# Altium schematic sheet Power_Architecture.SchDoc
size Tabloid; SheetNumber: 2; SheetTotal: 13
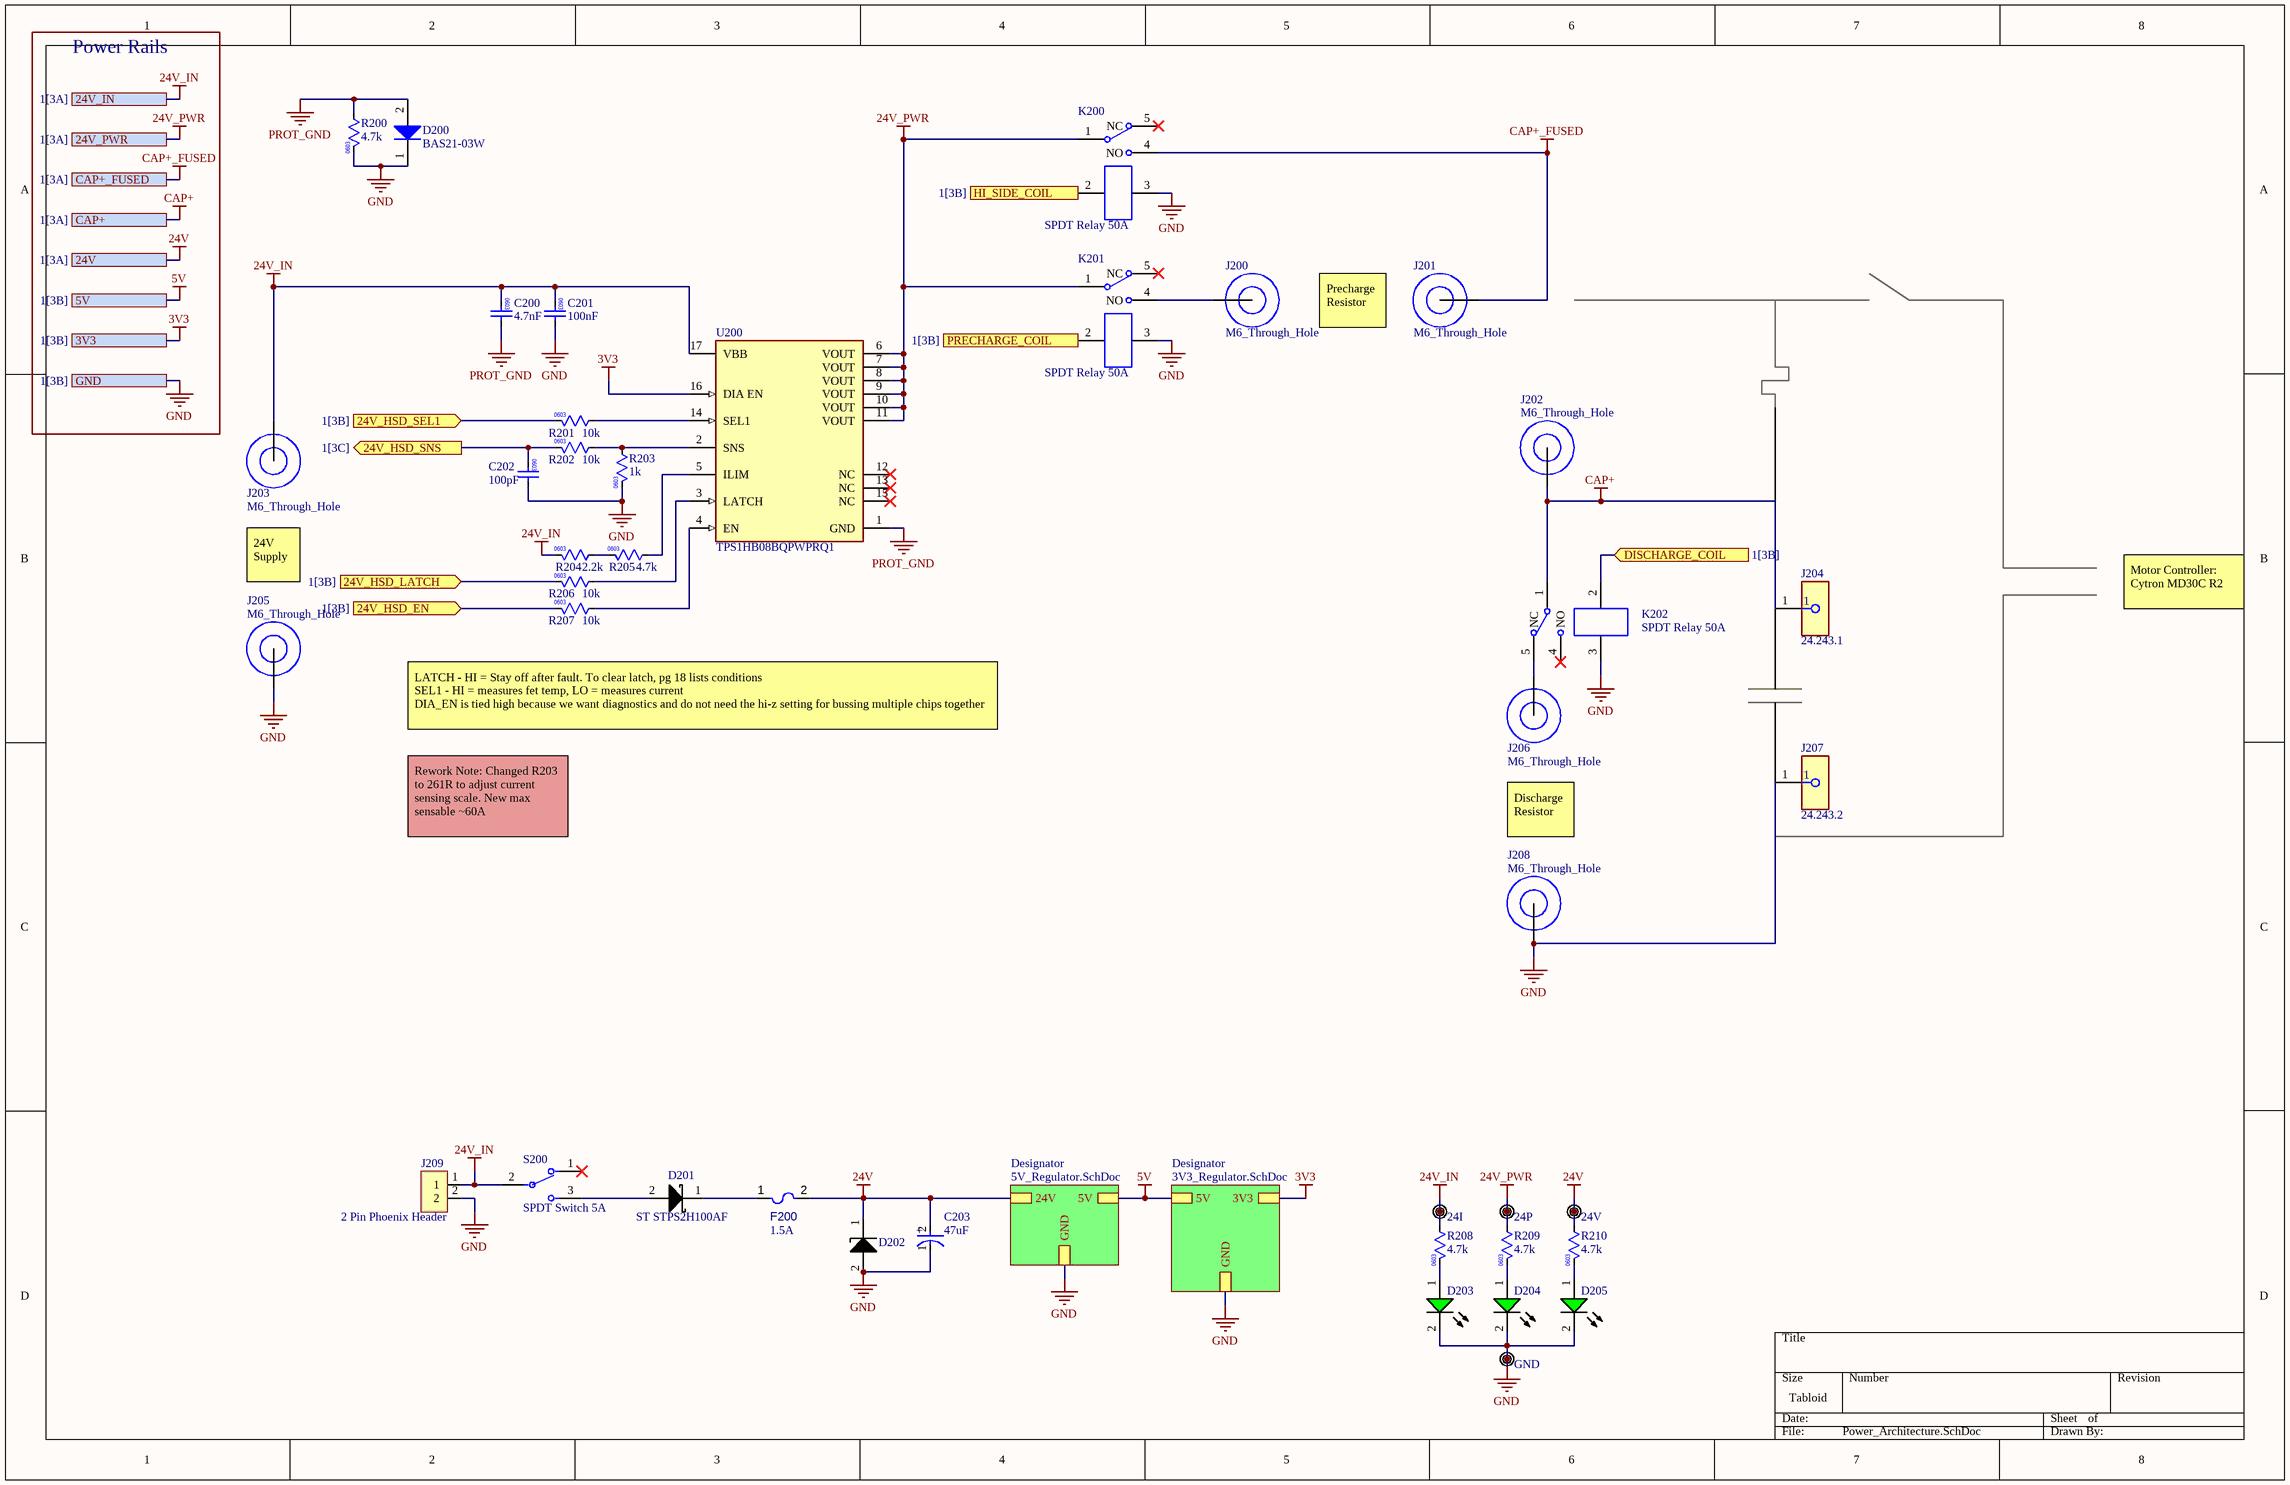
[diagram p0: Power_Architecture.SchDoc]

## Parts
C200  value 4.7nF  [0603 Capacitor Footprint]  (hidden comment: 0603 4.7nF 10% 50V)
C201  value 100nF  [0603 Capacitor Footprint]  (hidden comment: 0603 0.1uF 5% 50V)
C202  value 100pF  [0603 Capacitor Footprint]  (hidden comment: 0603 100pF 10% 50V)
C203  Capacitance: 47uF  [FP-FPD-MFG]  (hidden comment: EEEFP1V470AP)
D200  BAS21-03W  [INF-SOD323_V]
D201  ST STPS2H100AF  [ST STPS2H100AF]
D202  Vishay SMAJ24A-E3/5A  [VISHAY SMAJ24A-E3/5A (DO214AC/SMA)]  (value not drawn)
D203  Lite-On LTST-C193KGKT-5A  [Lite-On LTST-C193KGKT-5A GREEN (1608)]  (value not drawn)
D204  Lite-On LTST-C193KGKT-5A  [Lite-On LTST-C193KGKT-5A GREEN (1608)]  (value not drawn)
D205  Lite-On LTST-C193KGKT-5A  [Lite-On LTST-C193KGKT-5A GREEN (1608)]  (value not drawn)
F200  Current Rating: 1.5A  [LFUS-467_V]  (hidden comment: 1.5A 32V Fuse 0603)
GND  Thru-Hole Test Point  [TESTPOINT]  (value not drawn)  (no BOM)
J200  M6_Through_Hole  [M6_Through_Hole]  (no BOM)
J201  M6_Through_Hole  [M6_Through_Hole]  (no BOM)
J202  M6_Through_Hole  [M6_Through_Hole]  (no BOM)
J203  M6_Through_Hole  [M6_Through_Hole]  (no BOM)
J204  24.243.1  [FP-24_243_1-MFG]
J205  M6_Through_Hole  [M6_Through_Hole]  (no BOM)
J206  M6_Through_Hole  [M6_Through_Hole]  (no BOM)
J207  24.243.2  [FP-24_243_2-MFG]
J208  M6_Through_Hole  [M6_Through_Hole]  (no BOM)
J209  2 Pin Phoenix Header  [2 Pin Phoenix Header]
K200  SPDT Relay 50A  [SPDT Relay 50A]
K201  SPDT Relay 50A  [SPDT Relay 50A]
K202  SPDT Relay 50A  [SPDT Relay 50A]
R200  value 4.7k  [0603 Resistor Footprint]  (hidden comment: 0603 4k7 1% 0.33W)
R201  value 10k  [0603 Resistor Footprint]  (hidden comment: 0603 10k 1% 0.3W)
R202  value 10k  [0603 Resistor Footprint]  (hidden comment: 0603 10k 1% 0.3W)
R203  value 1k  [0603 Resistor Footprint]  (hidden comment: 0603 1k 1% 0.33W)
R204  value 2.2k  [0603 Resistor Footprint]  (hidden comment: 0603 2k2 1% 0.25W)
R205  value 4.7k  [0603 Resistor Footprint]  (hidden comment: 0603 4k7 1% 0.33W)
R206  value 10k  [0603 Resistor Footprint]  (hidden comment: 0603 10k 1% 0.3W)
R207  value 10k  [0603 Resistor Footprint]  (hidden comment: 0603 10k 1% 0.3W)
R208  value 4.7k  [0603 Resistor Footprint]  (hidden comment: 0603 4k7 1% 0.33W)
R209  value 4.7k  [0603 Resistor Footprint]  (hidden comment: 0603 4k7 1% 0.33W)
R210  value 4.7k  [0603 Resistor Footprint]  (hidden comment: 0603 4k7 1% 0.33W)
S200  SPDT Switch 5A  [SPDT 5A]
TP200  24I  [TESTPOINT]  (no BOM)
TP201  24P  [TESTPOINT]  (no BOM)
TP202  24V  [TESTPOINT]  (no BOM)
U200  TPS1HB08BQPWPRQ1  [FP-PWP0016M-MFG]

## Sub-sheets
Designator = 5V_Regulator.SchDoc: 24V, 5V, GND
Designator = 3V3_Regulator.SchDoc: 5V, GND, 3V3

## Ports
3V3 (see 1[3B]), 5V (see 1[3B]), 24V (see 1[3A]), 24V_HSD_EN (in, see 1[3B]), 24V_HSD_LATCH (in, see 1[3B]), 24V_HSD_SEL1 (in, see 1[3B]), 24V_HSD_SNS (out, see 1[3C]), 24V_IN (see 1[3A]), 24V_PWR (see 1[3A]), CAP+ (see 1[3A]), CAP+_FUSED (see 1[3A]), DISCHARGE_COIL (in, see 1[3B]), GND (see 1[3B]), HI_SIDE_COIL (in, see 1[3B]), PRECHARGE_COIL (in, see 1[3B])

## Nets
3V3: U200.16(DIA_EN) ; port 3V3, sheet Designator/3V3
5V: port 5V, sheet Designator/5V, sheet Designator/5V
24V: C203.2(A) D202.1 F200.2 R210.1 TP202.1(TP) ; port 24V, sheet Designator/24V
24V_IN: C200.2 C201.2 J203.1 J209.1 R204.2 R208.1 S200.2 TP200.1(TP) U200.17(VBB) ; port 24V_IN
24V_PWR: K200.1 K201.1 R209.1 TP201.1(TP) U200.6(VOUT) U200.7(VOUT) U200.8(VOUT) U200.9(VOUT) U200.10(VOUT) U200.11(VOUT) ; port 24V_PWR
CAP+: J202.1 J204.1 K202.1 ; port CAP+
CAP+_FUSED: J201.1 K200.4(NO) ; port CAP+_FUSED
GND: C201.1 C202.1 C203.1(C) D200.1(K) D202.2 D203.2(K) D204.2(K) D205.2(K) GND.1(TP) J205.1 J207.1 J208.1 J209.2 K200.3 K201.3 K202.3 R200.2 R203.2 ; port GND, sheet Designator/GND, sheet Designator/GND
PROT_GND: C200.1 D200.2(A) R200.1 U200.1(GND)
24V_HSD_EN: R207.2 ; port 24V_HSD_EN
24V_HSD_LATCH: R206.2 ; port 24V_HSD_LATCH
24V_HSD_SEL1: R201.2 ; port 24V_HSD_SEL1
24V_HSD_SNS: C202.2 R202.2 ; port 24V_HSD_SNS
DISCHARGE_COIL: K202.2 ; port DISCHARGE_COIL
HI_SIDE_COIL: K200.2 ; port HI_SIDE_COIL
PRECHARGE_COIL: K201.2 ; port PRECHARGE_COIL
NetD201_1: D201.1 F200.1
NetD201_2: D201.2 S200.3
NetD203_1: D203.1(A) R208.2
NetD204_1: D204.1(A) R209.2
NetD205_1: D205.1(A) R210.2
NetJ200_1: J200.1 K201.4(NO)
NetJ206_1: J206.1 K202.5(NC)
NetR201_1: R201.1 U200.14(SEL1)
NetR202_1: R202.1 R203.1 U200.2(SNS)
NetR204_1: R204.1 R205.2
NetR205_1: R205.1 U200.5(ILIM)
NetR206_1: R206.1 U200.3(LATCH)
NetR207_1: R207.1 U200.4(EN)

Not connected (* = marked no-connect by the designer): K200 5(NC)*; K201 5(NC)*; K202 4(NO)*; S200 1*; U200 12(NC)* 13(NC)* 15(NC)*

## Notes on the sheet
- Power Rails
- Precharge Resistor
- 24V Supply
- Motor Controller: Cytron MD30C R2
- LATCH - HI = Stay off after fault. To clear latch, pg 18 lists conditions
  SEL1 - HI = measures fet temp, LO = measures current
  DIA_EN is tied high because we want diagnostics and do not need the hi-z setting for bussing multiple chips together
- Rework Note: Changed R203 to 261R to adjust current sensing scale. New max sensable ~60A
- Discharge Resistor
- (in symbol CMP-009-00190-8) 0603
- (in symbol CMP-2000-06216-2) +

## Library data of the parts
C200 = CMP-001-00087-1: Ceramic Capacitor, Multilayer, Ceramic, 50V, 10% Tol, X7R, 15% TC, 0.0047uF, Surface Mount, 0603; Max Operating Temperature: 125°C; Case/Package: 0603; Capacitor Type: Ceramic; Min Operating Temperature: -55°C; Tolerance: 10%; Supplier Part Number 1: 13-CC0603KPX7R9BB101CT-ND; RoHS Compliant: Yes; Temperature Characteristics Code: X7R; Mounting Technology: Surface Mount; Source: UBC Formula Electric.SchLib; Voltage Rating: 50V; Pins: 2
C201 = CMP-001-00091-5: CAP CER 0.1UF 50V X7R 0603; Manufacturer Part Number: CC0603JPX7R9BB104; Capacitor Type: Ceramic; Case/Package: 0603; Tolerance: 5%; Voltage Rating: 50V; Mounting Technology: SF
C202 = CMP-001-00096-1: Ceramic Capacitor, Multilayer, Ceramic, 50V, 10% +Tol, 10% -Tol, X7R, 15% TC, 0.0001uF, Surface Mount, 0603; Min Operating Temperature: -55°C; Voltage Rating: 50V; Tolerance: 10%; Supplier 1: Yageo; Capacitor Type: Ceramic; Pins: 2; Case/Package: 0603; Mounting Technology: Surface Mount; RoHS Compliant: Yes; Source: UBC Formula Electric.SchLib; Max Operating Temperature: 125°C; Supplier Part Number 1: 13-CC0603KPX7R9BB101CT-ND; Temperature Characteristics Code: X7R
C203 = CMP-2000-06216-2: CAP ALUM 47UF 20% 35V SMD; Ripple Current: 300mA; ESR (Equivalent Series Resistance): 260mR; Life (Hours): 2000Hour; Leakage Current: 3uA; Dissipation Factor: 0.12%; Material: Aluminium; Series: FP; Construction: Cylindrical; Contact Plating: Tin; Termination: SMD/SMT; RoHS Compliant: Yes; Voltage Rating (DC): 35V; Package Quantity: 1; Tolerance: 20%; Mount: Surface Mount; Diameter: 6.3mm; Lead Free: Lead Free; Number of Pins: 2; Radiation Hardening: No; REACH SVHC: No SVHC; Length: 5.8mm; Height - Seated (Max): 0.228inch; Ripple Current (AC): 300mA; Packaging: Tape and Reel; Voltage Rating: 35V; Min Operating Temperature: -55°C; Voltage: 35V; Case/Package: Radial; Max Operating Temperature: 105°C; Height: 5.8mm; Lead Pitch: 1.8mm
D200 = CMP-1176-00009-1: Silicon Switching Diode, SOD323, Reel, Green; Manufacturer: Infineon; IF (max): 250Â mA; VBR (min): 250Â V; Green: TRUE; Configuration: Single; VR (max): 200Â V; IR (max): 100Â nA; VF (max): 1.25Â V; trr (max): 50Â ns; PackageReference: SOD323; ComponentLink3URL: http://www.infineon.com/dgdl/SOD323-Package_Overview.pdf?folderId=db3a30431936bc4b011952aab84f3bbe&fileId=db3a30431936bc4b011952beed653be3; ComponentLink1URL: http://www.infineon.com/; Mounting Technology: Surface Mount; ComponentLink3Description: Package Specification; ComponentLink2URL: http://www.infineon.com/dgdl/bas21series.pdf?folderId=db3a30431400ef6801141b5844e103ea&fileId=db3a30431400ef6801141bed353f040f; PartNumber: BAS21-03W; ComponentLink2Description: Datasheet; ComponentLink1Description: Manufacturer URL; PackageDescription: 2-Pin Small Outline Diode Package, 1.25 x 1.7 mm Body
D201 = CMP-011-0012-1: Diode Schottky 100V 2A Surface Mount SMAflat; Component Type: Standard; Source: Quad_Inverter.SchLib; Design Item ID: ST STPS2H100AF; Pins: 2
D202 = CMP-024-000024-1: TVS DIODE 24V 38.9V DO214AC; Source: UBC Formula Electric.SchLib; Supplier Part Number 1: SMAJ24A-E3/5AGICT-ND; Reverse Standoff: 24V; Design Item ID: Vishay SMAJ24A-E3/5A; Supplier 1: Digi-Key
D203-D205 = CMP-026-000009-1: LED GREEN CLEAR CHIP SMD; Source: UBC Formula Electric.SchLib; Supplier 1: Digi-Key; Supplier Part Number 1: 160-1828-1-ND; Design Item ID: Lite-On LTST-C193KGKT-5A
F200 = CMP-005-00014-1: Electric Fuse, Slow Blow, 1.5A, 32VDC, 50A (IR), Surface Mount; Case/Package: 0603; Pins: 2; Min Operating Temperature: -20°C; Max Operating Temperature: 105°C; Mounting Technology: Surface Mount; Voltage Rating - DC: 32V; RoHS Compliant: Yes
GND TP200-TP202 = CMP-020-0000-4: Design Item ID: Thru-Hole Test Point; Source: UBC Formula Electric.SchLib
J204 = CMP-12400-000001-2: Banana Test Connector, 4mm, Socket, PCB Mount, 24 A, 60 VDC, Silver Plated Contacts, Green; Gender: Male; Voltage Rating: 30V; Current Rating: 20A; REACH SVHC: No SVHC; Contact Material: Brass; RoHS Compliant: Yes; Contact Plating: Silver; Voltage Rating (DC): 30V; Length: 24mm; Termination: Solder
J207 = CMP-12400-000002-2: RECEPTACLE, 20A, 4MM, PCB, SOLDER, BLACK; Gender: Male; Current Rating: 20A; Contact Plating: Silver; Termination: Solder; Length: 24mm; REACH SVHC: No SVHC; Contact Material: Brass
R200 R205 R208-R210 = CMP-009-00182-7: RES SMD 4.7K OHM 1% 1/3W 0603; Manufacturer Part Number: CRCW06034K70FKEAHP; Power: 250mW; Tolerance: 1%; Case/Package: 0603; Pins: 2; RoHS Compliant: Yes; Min Operating Temperature: -55°C; Mounting Technology: Surface Mount; Digikey Part Number: 541-4.70KSCT-ND; Max Operating Temperature: 155°C
R201 R202 R206 R207 = CMP-009-00181-10: RES SMD 10K OHM 1% 1/3W 0603; Manufacturer Part Number: CRCW060310K0FKEAHP; Power: 333mW; Case/Package: 0603; Max Operating Temperature: 155°C; Min Operating Temperature: -55°C; Pins: 2; Digikey Part Number: 541-10.0KSCT-ND; RoHS Compliant: Yes; Tolerance: 1%; Mounting Technology: Surface Mount
R203 = CMP-009-00184-7: RES SMD 1K OHM 1% 1/3W 0603; Manufacturer Part Number: CRCW06031K00FKEAHP; Power: 250mW; RoHS Compliant: Yes; Pins: 2; Min Operating Temperature: -55°C; Max Operating Temperature: 155°C; Tolerance: 1%; Digikey Part Number: 541-1.00KSCT-ND; Case/Package: 0603; Mounting Technology: Surface Mount
R204 = CMP-009-00190-8: RES SMD 2.2K OHM 1% 1/4W 0603; Manufacturer Part Number: RCS06032K20FKEA; Digikey Part Number: 541-10449-1-ND
U200 = CMP-00024-00007-1: Power Switch/Driver 1:1 N-Channel 70A 16-HTSSOP; Voltage Rating: 28V; Min Operating Temperature: -40°C; Case/Package: 16-HTSSOP; Max Operating Temperature: 125°C
K200-K202 = SPDT Relay 50A: Supplier 1: Digi-Key; Supplier Part Number 1: 2449-J115F11CH24VDCS61.5-ND